# EAGLE design beginner-kit.v3 (EAGLE 5.10)
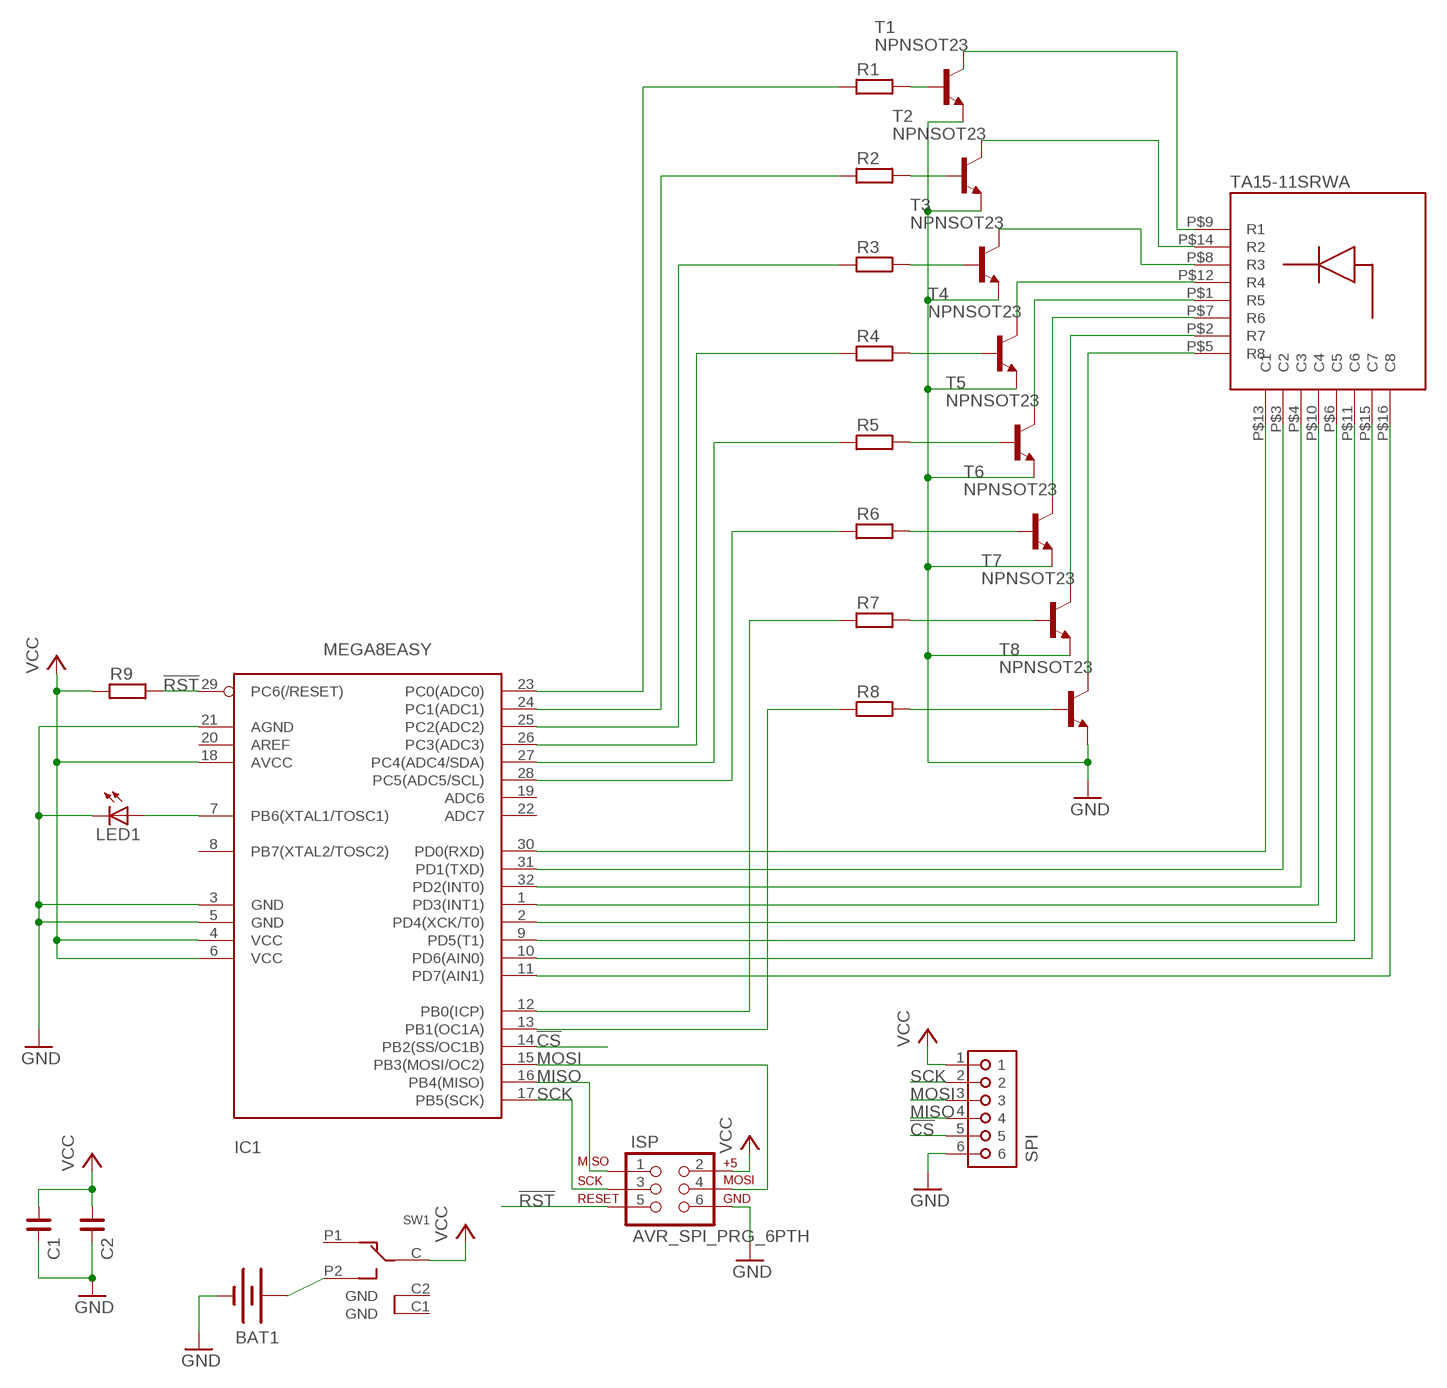
[diagram p0: schematic, sheet 1]

## Parts
BAT1  BATTERY20SMD  [BATTCON_20MM]
C1  C_1206  [1206]
C2  C_1206  [1206]
IC1  MEGA8EASY  [TQFP32-08-OUTLINE-EASY]
ISP  AVR_SPI_PRG_6PTH  [2X3]
LED1  LED1206  [LED1206]
R1  R_1206  [1206]
R2  R_1206  [1206]
R3  R_1206  [1206]
R4  R_1206  [1206]
R5  R_1206  [1206]
R6  R_1206  [1206]
R7  R_1206  [1206]
R8  R_1206  [1206]
R9  R_1206  [1206]
SPI  CON6M  [1X06]
SW1  1P2T  [CSS-1210TB-BOX]
T1  NPNSOT23  [SOT23]
T2  NPNSOT23  [SOT23]
T3  NPNSOT23  [SOT23]
T4  NPNSOT23  [SOT23]
T5  NPNSOT23  [SOT23]
T6  NPNSOT23  [SOT23]
T7  NPNSOT23  [SOT23]
T8  NPNSOT23  [SOT23]
U$1  TA15-11SRWA  TA15-11SRWABL  [BL-M15A881-2]

## Nets
!CS: IC1.14(PB2(SS/OC1B)) SPI.5
!RST: IC1.29(PC6(/RESET)) ISP.5 R9.2
GND: BAT1.2(-) C1.2 C2.2 IC1.3(GND) IC1.5(GND) IC1.21(AGND) ISP.6 LED1.C SPI.6 T1.2(E) T2.2(E) T3.2(E) T4.2(E) T5.2(E) T6.2(E) T7.2(E) T8.2(E)
MISO: IC1.16(PB4(MISO)) ISP.1 SPI.4
MOSI: IC1.15(PB3(MOSI/OC2)) ISP.4 SPI.3
N$1: BAT1.1(+) SW1.P2
N$2: T1.3(C) U$1.P$9(R1)
N$3: IC1.7(PB6(XTAL1/TOSC1)) LED1.A
N$4: T2.3(C) U$1.P$14(R2)
N$5: R3.2 T3.1(B)
N$6: R4.2 T4.1(B)
N$7: R5.2 T5.1(B)
N$8: R6.2 T6.1(B)
N$9: R7.2 T7.1(B)
N$10: R8.2 T8.1(B)
N$11: T3.3(C) U$1.P$8(R3)
N$12: T4.3(C) U$1.P$12(R4)
N$13: T5.3(C) U$1.P$1(R5)
N$14: T6.3(C) U$1.P$7(R6)
N$15: R1.2 T1.1(B)
N$16: T7.3(C) U$1.P$2(R7)
N$17: T8.3(C) U$1.P$5(R8)
N$18: IC1.11(PD7(AIN1)) U$1.P$16(C8)
N$19: IC1.10(PD6(AIN0)) U$1.P$15(C7)
N$20: IC1.9(PD5(T1)) U$1.P$11(C6)
N$21: IC1.2(PD4(XCK/T0)) U$1.P$6(C5)
N$22: IC1.1(PD3(INT1)) U$1.P$10(C4)
N$23: IC1.32(PD2(INT0)) U$1.P$4(C3)
N$24: IC1.31(PD1(TXD)) U$1.P$3(C2)
N$25: IC1.30(PD0(RXD)) U$1.P$13(C1)
N$26: IC1.28(PC5(ADC5/SCL)) R6.1
N$27: IC1.27(PC4(ADC4/SDA)) R5.1
N$28: IC1.26(PC3(ADC3)) R4.1
N$29: R2.2 T2.1(B)
N$30: IC1.25(PC2(ADC2)) R3.1
N$31: IC1.24(PC1(ADC1)) R2.1
N$32: IC1.23(PC0(ADC0)) R1.1
N$33: IC1.12(PB0(ICP)) R7.1
N$34: IC1.13(PB1(OC1A)) R8.1
SCK: IC1.17(PB5(SCK)) ISP.3 SPI.2
VCC: C1.1 C2.1 IC1.4(VCC) IC1.6(VCC) IC1.18(AVCC) ISP.2 R9.1 SPI.1 SW1.C
Unconnected: IC1.8(PB7(XTAL2/TOSC2)) IC1.19(ADC6) IC1.20(AREF) IC1.22(ADC7) SW1.C1(GND) SW1.C2(GND) SW1.P1

## Library data of the parts
BAT1 = SparkFun:BATTERY: Battery Holders Various common sizes : AA, AAA, 20mm coin cell and 12mm coin cell.
C1 C2 = transistors-smt:C_: NON-POLARIZED CAP
IC1 = avr:MEGA8: MICROCONTROLLER 8 Kbytes FLASH 1 kbytes SRAM 512 bytes EEPROM USART 6-channel 10 bit ADC 2-channel 8 bit ADC
ISP = SparkFun:AVR_SPI_PRG_6: AVR ISP 6 Pin This is the reduced ISP connector for AVR programming. Common on Arduino. This footprint will take up less PCB space and can be used with a 10-pin to 6-pin adapter such as SKU: BOB-08508
LED1 = LED:LED: LEDs Standard schematic elements and footprints for 5mm, 3mm, 1206, and 0603 sized LEDs. 5mm - Spark Fun Electronics SKU : COM-00529 (and others)
R1-R9 = transistors-smt:R_: RESISTOR
SPI = connectors:CON6
SW1 = switches:1P2T: C&K Components AYZ0102AGRLC
T1-T8 = transistors-smt:NPN: NPN TRANSISTOR
U$1 = additional:TA15-11SRWA: futurlec?!

## Board
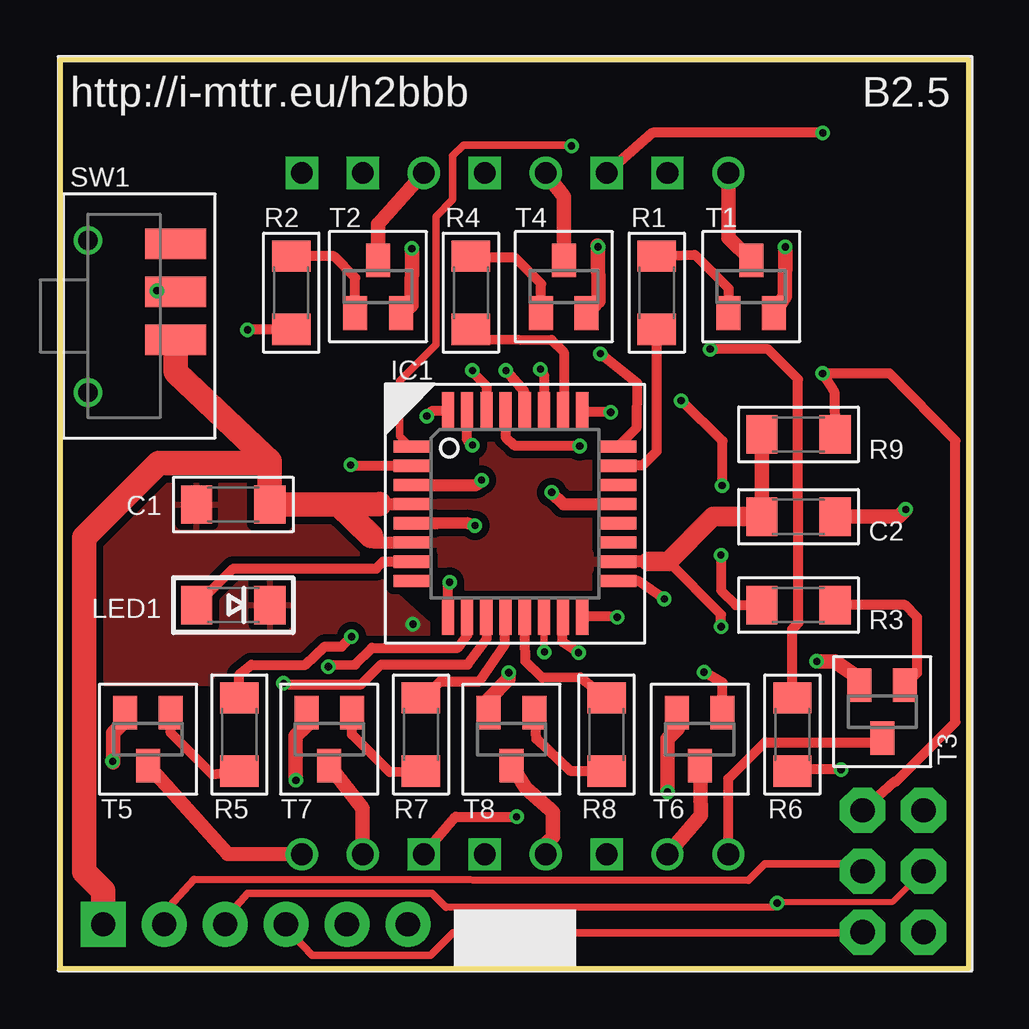
[diagram p1: board, top side]
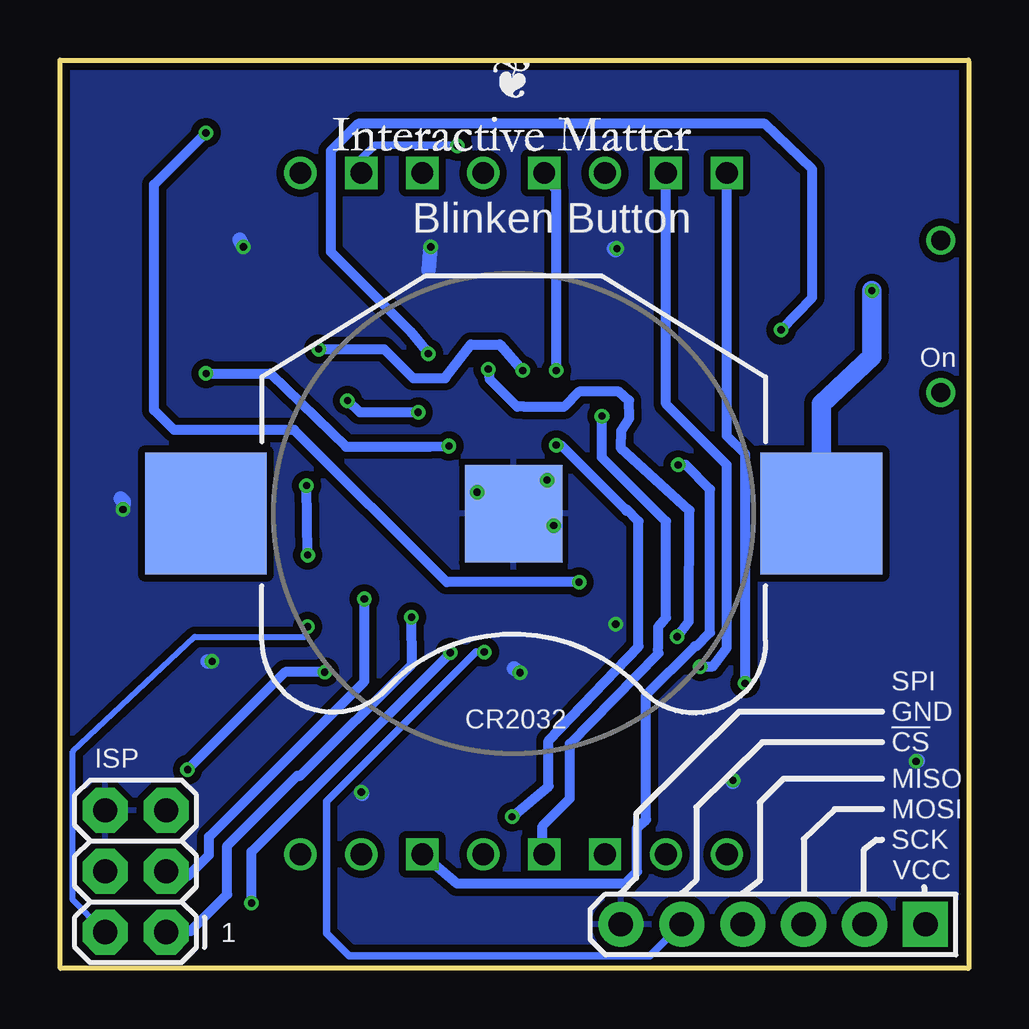
[diagram p2: board, bottom side, seen from below]

Size 37.88 x 37.88 mm. Coordinates in mm from the lower left corner, seen from the top.
Outline: 37.88,0.04 37.88,37.88 0.01,37.88
Outline: 0.03,0.01 37.87,0.01
Outline: 0,37.83 0,0
Copper layers (1*16): Top 0.035mm / dielectric 1.5mm / Bottom 0.035mm
Design rules "makepcb *": minimum track width 0.2mm, minimum drill 0.3mm, track to track 0.2mm, track to pad 0.2mm, pad to pad 0.2mm, via to via 0.2mm, smd to smd 0mil, copper to edge 10mil, drill to drill 0.2mm, minimum pad ring 6mil, minimum via ring 6mil, stop-mask expansion 4mil, vias tented up to drill 25mil, thermal gap 10mil

### Footprints (pad centres in the part's own frame; a part is rotated, then mirrored left to right if it is on the bottom)
BATTCON_20MM = smd 5.08 x 5.08: 1 -12.827,0; 3 12.827,0 | smd 4.064 x 4.064: 2 0,0
1206 = smd 1.3 x 1.6: 1 -1.524,0; 2 1.524,0
TQFP32-08-OUTLINE-EASY = smd 1.54 x 0.508: 1 -4.293,2.8; 2 -4.293,2; 3 -4.293,1.2; 4 -4.293,0.4; 5 -4.293,-0.4; 6 -4.293,-1.2; 7 -4.293,-2; 8 -4.293,-2.8; 17 4.293,-2.8; 18 4.293,-2; 19 4.293,-1.2; 20 4.293,-0.4; 21 4.293,0.4; 22 4.293,1.2; 23 4.293,2; 24 4.293,2.8 | smd 0.508 x 1.54: 9 -2.8,-4.293; 10 -2,-4.293; 11 -1.2,-4.293; 12 -0.4,-4.293; 13 0.4,-4.293; 14 1.2,-4.293; 15 2,-4.293; 16 2.8,-4.293; 25 2.8,4.293; 26 2,4.293; 27 1.2,4.293; 28 0.4,4.293; 32 -2.8,4.293 | smd 0.5 x 1.54: 29 -0.4,4.293; 30 -1.2,4.293; 31 -2,4.293
2X3 = drill 1.016 pad 1.88 octagon: 1 0,0; 2 0,2.54; 3 2.54,0; 4 2.54,2.54; 5 5.08,0; 6 5.08,2.54
LED1206 = smd 1.3 x 1.6: A 1.524,0; C -1.524,0
1X06 = drill 1.016 pad 1.88 square: 1 0,0 | drill 1.016 pad 1.88 round: 2 2.54,0; 3 5.08,0; 4 7.62,0; 5 10.16,0; 6 12.7,0
CSS-1210TB-BOX = smd 1.27 x 2.54: C 1,2.15; P1 -3,2.15; P2 -1,2.15 | drill 0.8 round: C1 -3.15,-1.5; C2 3.2,-1.5
SOT23 = smd 1 x 1.4: 1 -0.95,-1.1; 2 0.95,-1.1; 3 0,1.1
BL-M15A881-2 = drill 0.9 round: P$1 -8.89,-14.2; P$2 -6.35,-14.2; P$5 1.27,-14.2; P$7 6.35,-14.2; P$8 8.89,-14.2; P$9 8.89,14.2; P$12 1.27,14.2; P$14 -3.81,14.2 | drill 0.9 square: P$3 -3.81,-14.2; P$4 -1.27,-14.2; P$6 3.81,-14.2; P$10 6.35,14.2; P$11 3.81,14.2; P$13 -1.27,14.2; P$15 -6.35,14.2; P$16 -8.89,14.2

### Placement (x,y rotation side)
BAT1  18.97,18.97 180 bottom
C1  7.23,19.35 180 top
C2  30.78,18.84 0 top
IC1  18.97,18.97 0 top
ISP  33.46,1.52 90 bottom
LED1  7.23,15.16 180 top
R1  24.88,28.18 90 top
R2  9.64,28.18 90 top
R3  30.78,15.16 0 top
R4  17.13,28.18 90 top
R5  7.48,9.76 270 top
R6  30.53,9.76 270 top
R7  15.05,9.76 270 top
R8  22.78,9.76 270 top
R9  30.78,22.27 0 top
SPI  1.8,1.85 180 bottom
SW1  2.67,27.21 270 top
T1  28.82,28.43 0 top
T2  13.26,28.43 0 top
T3  34.28,10.71 180 top
T4  21,28.43 0 top
T5  3.67,9.57 180 top
T6  26.67,9.57 180 top
T7  11.23,9.57 180 top
T8  18.82,9.57 180 top
U$1  18.97,18.97 0 top
U$2  [SMALLER_BOTTOM]  11.43,33.37 0 top

### Tracks (layer width: path | path; a pad name or v marks a point on that pad's centre or on a via)
!CS  (via drill 0.3)
  Top 0.305: IC1.14 20.17,13.22 v20.19,13.2
  Bottom 0.305: v20.19,13.2 20.55,13.2 26.77,6.98 26.77,1.47 25.83,0.53 13.28,0.53 SPI.5
!RST  (via drill 0.3)
  Top 0.406: v21.66,21.79 18.97,21.79 18.59,22.14 18.59,23.24 IC1.29 | ISP.5 34.78,7.79 34.85,7.79 37.32,10.27 37.32,22.02 34.59,24.81 v31.79,24.81 32.28,24.06 R9.2
  Bottom 0.406: v31.79,24.81 29.11,24.81 25.96,21.76 22.46,21.76 v21.66,21.79
GND  (via drill 0.3)
  Top 0.508: v17.3,18.47 16.99,18.57 15.72,18.57 IC1.5 | IC1.21 20.99,19.37 v20.5,19.86 | IC1.3 17.38,20.17 v17.58,20.36
  Top 0.61: T2.2 14.21,27.28 14.65,27.65 v14.67,30.02 | T4.2 21.95,27.28 22.45,27.83 v22.43,30.09 22.4,30.14 | T1.2 30.22,28.03 v30.24,30.09 | T5.2 2.72,10.33 2.21,9.82 2.21,8.6 v2.2,8.64 | T7.2 10.28,10.14 9.83,9.7 v9.83,7.86 | 17.93,10.67 17.93,10.46 T8.2 17.85,10.68 17.85,11.22 18.71,12.07 v18.71,12.34 | T6.2 25.77,10.02 25.32,9.57 v25.32,7.36 25.32,7.54 | T3.2 33.26,11.99 33.32,12.11 32.31,12.81 v31.55,12.81 | C2.2 34.98,18.84 v35.25,19.15
  Bottom 0.61: 17.7,17.32 v17.3,18.47 17.83,17.82 BAT1.2 | v20.5,19.86 20.37,19.86 20.12,20.11 BAT1.2 | v17.58,20.36 BAT1.2 | v14.67,30.02 14.72,29.95 14.78,30.02 | v22.43,30.09 22.53,29.13 | v30.24,30.09 30.4,30.4 | v2.2,8.64 2.13,8.66 | v9.83,7.86 9.83,7.79 | v18.71,12.34 18.96,12.52 | 25.3,7.28 v25.32,7.36 | v31.55,12.81 31.74,12.81 | v35.25,19.15 35.23,19.48 35.36,19.6
  other vias: 14.72,14.36
  pour Bottom (isolate 0.305): -0.27,38.08 38.02,38.08 38.02,-0.27 -0.27,-0.27
  pour Top (isolate 0.305): 13.84,23.72 6.78,23.69 0.99,17.9 0.99,12.69 1.8,11.88 15.26,11.91 15.32,13.46 15.32,14.4 13.64,15.92 13.84,23.16
MISO  (via drill 0.3)
  Top 0.305: SPI.4 9.42,1.7 10.52,0.55 15.44,0.55 16.38,1.49 32.87,1.49 ISP.1
  Top 0.406: IC1.16 22.86,14.68 v23.23,14.65
  Bottom 0.406: v23.23,14.65 23.22,12.69 27.86,8.05 27.99,8.05 30.91,5.12 30.91,3.09 32.44,1.57 33.52,1.57 ISP.1
MOSI  (via drill 0.3)
  Top 0.254: 30.01,2.79 34.73,2.79 ISP.4
  Top 0.305: SPI.3 6.88,2.08 7.82,3.14 15.52,3.14 16.1,2.56 29.82,2.58 v29.89,2.74
  Top 0.406: IC1.15 20.95,13.61 v21.61,13.18 | v29.89,2.74 30.01,2.79
  Bottom 0.406: v21.61,13.18 21.64,13.13 29.89,4.87 v29.89,2.74
N$1  (via drill 0.3)
  Top 0.813: v4.04,28.26 4.85,28.21 SW1.P2
  Bottom 0.813: BAT1.1 6.15,23.54 4.04,25.52 v4.04,28.26
N$2
  Top 0.61: T1.3 27.86,30.48 U$1.P$9
N$3
  Top 0.406: IC1.7 13.47,16.97 13.18,16.68 7.23,16.68 LED1.A
N$4
  Top 0.61: T2.3 13.26,31.03 U$1.P$14
N$5
  Top 0.406: R3.2 35.23,15.16 35.74,14.65 35.74,12.32 T3.1
N$6
  Top 0.406: T4.1 20.05,28.55 18.97,29.64 17.26,29.64 R4.2
N$7
  Top 0.406: T5.1 4.62,9.83 6.34,8.11 R5.2
N$8  (via drill 0.3)
  Top 0.406: T6.1 27.62,11.92 v26.85,12.36 | v32.56,8.3 30.78,8.3 R6.2
  Bottom 0.406: v26.85,12.36 28.5,12.36 v32.56,8.3
N$9
  Top 0.406: T7.1 12.18,9.76 13.74,8.2 R7.2
N$10
  Top 0.406: T8.1 19.86,9.57 21.26,8.25 R8.2
N$11
  Top 0.406: U$1.P$8 27.86,7.92 29.39,9.44 34.11,9.44 T3.3
N$12
  Top 0.61: T4.3 21,32.18 U$1.P$12
N$13
  Top 0.61: T5.3 6.99,4.79 U$1.P$1
N$14
  Top 0.61: T6.3 26.72,6.4 U$1.P$7
N$15
  Top 0.406: T1.1 27.86,28.36 26.47,29.76 R1.2
N$16
  Top 0.61: T7.3 12.62,6.69 U$1.P$2
N$17
  Top 0.61: T8.3 19.42,7.52 20.43,6.65 20.56,6.52 20.56,5.51 20.24,5.19 U$1.P$5
N$18  (via drill 0.3)
  Top 0.406: IC1.11 17.8,13.77 16.99,12.68 13.38,12.68 12.56,11.86 9.51,11.86 v9.32,11.89
  Bottom 0.406: U$1.P$16 10.08,22.21 9.32,21.44 v9.32,11.89
N$19  (via drill 0.3)
  Top 0.406: IC1.10 16.97,13.89 16.58,13.38 13,13.38 12.31,12.68 11.28,12.66 v11.19,12.59
  Bottom 0.406: U$1.P$15 12.62,23.54 10.08,21 10.08,13.38 10.65,12.6 v11.19,12.59
N$20  (via drill 0.3)
  Top 0.406: IC1.9 16.17,16.04 v16.24,16.11 | v31.8,34.84 24.69,34.84 U$1.P$11
  Bottom 0.406: v16.24,16.11 21.77,16.11 28.12,22.46 33.13,22.46 33.96,23.29 33.96,32.68 v31.8,34.84
N$21  (via drill 0.3)
  Top 0.406: IC1.2 12.15,20.97 v12.12,21
  Bottom 0.406: v12.12,21 11.8,21 10.78,19.98 10.78,14.01 11.35,13.44 11.42,13.44 13.45,11.41 13.45,6.21 13.83,5.89 13.83,4.05 14.34,3.54 21.32,3.54 U$1.P$6
N$22  (via drill 0.3)
  Top 0.305: IC1.1 14.59,21.77 14.15,22.21 14.15,24.49 15.67,26.02 15.67,31.35 16.37,32.05 16.37,33.89 16.81,34.34 21.13,34.34 v21.32,34.3
  Bottom 0.305: v21.32,34.3 21.64,34.34 24.75,34.34 25.32,33.76 U$1.P$10
N$23  (via drill 0.3)
  Top 0.406: IC1.32 15.52,23.26 v15.29,23.03
  Bottom 0.406: v15.29,23.03 15.29,21.32 12.62,18.65 12.62,14.62 12.94,14.24 12.94,13.47 12.95,13.2 12.93,13.15 16.62,9.38 16.62,7.09 17.77,5.95 17.77,5.06 U$1.P$4
N$24  (via drill 0.3)
  Top 0.406: IC1.31 16.97,22.05 v17.19,21.82 | v19.04,6.33 16.5,6.33 U$1.P$3
  Bottom 0.406: v17.19,21.82 17,21.82 14.27,19.09 14.27,19.16 13.77,18.65 13.77,13.44 17.51,9.51 17.51,7.6 v19.04,6.33
N$25  (via drill 0.3)
  Top 0.406: IC1.30 17.77,24.3 17.19,24.87 v17.19,24.94
  Bottom 0.406: v17.19,24.94 17.19,32.43 U$1.P$13
N$26  (via drill 0.3)
  Top 0.406: R6.1 30.53,14.14 30.78,14.42 30.77,24.57 29.51,25.83 v27.1,25.83 | v18.59,24.94 19.35,24.05 19.35,23.28 IC1.28
  Bottom 0.406: v18.59,24.94 19.54,26.02 20.75,26.02 21.83,24.62 23.16,24.62 24.37,25.83 v27.1,25.83
N$27  (via drill 0.3)
  Top 0.406: IC1.27 20.17,24.76 v20.03,24.99 | R5.1 7.47,11.11 7.47,12.26 7.97,12.67 10.23,12.67 11.05,13.43 11.74,13.43 v12.15,13.84
  Bottom 0.406: v20.03,24.99 19.96,24.56 18.82,23.42 18.52,23.42 18.51,23.41 16.88,23.41 16.24,24.05 14.58,24.05 14.16,23.69 14.15,22.95 14.48,22.43 14.5,21.7 11.64,19.11 11.67,14.47 v12.15,13.84
N$28
  Top 0.406: R4.1 17.19,26.71 17.81,26.24 20.5,26.21 21,25.7 21,23.29 IC1.26
N$29
  Top 0.406: T2.1 12.31,28.81 11.42,29.7 R2.2
N$30  (via drill 0.3)
  Top 0.406: 25.91,23.71 v25.9,23.68 27.62,22 v27.6,20.14 | v22.95,23.19 21.8,23.21 IC1.25 | R3.1 28.17,15.16 27.56,15.77 v27.56,17.24
  Bottom 0.406: v25.9,23.68 25.38,23.19 v22.95,23.19 | v27.56,17.24 v27.6,20.14
N$31  (via drill 0.3)
  Top 0.406: v22.53,25.64 24.06,24.43 24.03,22.53 IC1.24 | R2.1 v7.82,26.63
  Bottom 0.406: v22.53,25.64 23.29,26.59 26.59,29.89 26.59,34.08 25.45,35.22 8.49,35.22 6.53,33.32 6.53,27.98 v7.82,26.63
N$32
  Top 0.406: R1.1 24.88,21.57 24.31,21 23.3,21 IC1.23
N$33
  Top 0.406: IC1.12 18.55,13.53 17.49,11.98 15.86,11.98 R7.1
N$34
  Top 0.406: IC1.13 19.4,12.81 20.1,12.13 21.68,12.16 R8.1
SCK  (via drill 0.3)
  Top 0.305: SPI.2 4.34,2.36 5.59,3.73 28.7,3.68 29.39,4.36 33.16,4.36 ISP.3
  Top 0.406: IC1.17 24.12,16.15 v25.2,15.41
  Bottom 0.406: v25.2,15.41 25.2,11.98 31.67,5.51 31.67,4.74 32.56,3.85 33.39,3.85 ISP.3
VCC  (via drill 0.3)
  Top 0.406: v27.56,14.26 27.56,14.76 25.35,16.97
  Top 0.508: 13.32,19.36 IC1.4 | 12.97,18.04 13.05,17.77 13.23,17.77 IC1.6 | 24.53,16.97 IC1.18
  Top 0.61: C2.1 R9.1 | C1.1 8.82,19.42
  Top 0.813: 24.53,16.97 24.86,16.97 25.35,16.97 27.23,18.84 C2.1
  Top 1.016: 11.61,19.35 13.32,19.36 | 11.61,19.35 12.97,18.04 | SW1.C 4.82,24.89 4.87,24.82 8.49,21.39 | SPI.1 1.8,3.25 1.02,4.03 1.02,17.98 4.11,21.08 8.18,21.08 8.49,21.39 | 11.61,19.35 C1.1 8.74,19.36 8.74,21.15 8.49,21.39
  Bottom 0.254: 36.12,1.63 37.36,2.87 37.35,9.05 32.26,13.84 27.67,13.84 v27.56,14.26
  Bottom 0.406: ISP.2 36.12,1.63
  pour Top (isolate 0.305): 16.15,23.29 14.65,21.79 14.65,16.2 14.63,16.17 16.15,14.65 21.77,14.65 21.77,14.73 23.24,16.2 23.24,21.76 23.27,21.79 23.27,21.81 21.79,23.29

### Text on the board
tNames: http://i-mttr.eu/h2bbb | B2.5
bNames: Blinken Button | On | GND | CR2032 | !CS | MISO | MOSI | SCK | VCC | 1
tDocu: GND Plane | VCC Plane